# EAGLE design alarme2 (EAGLE 4.11)
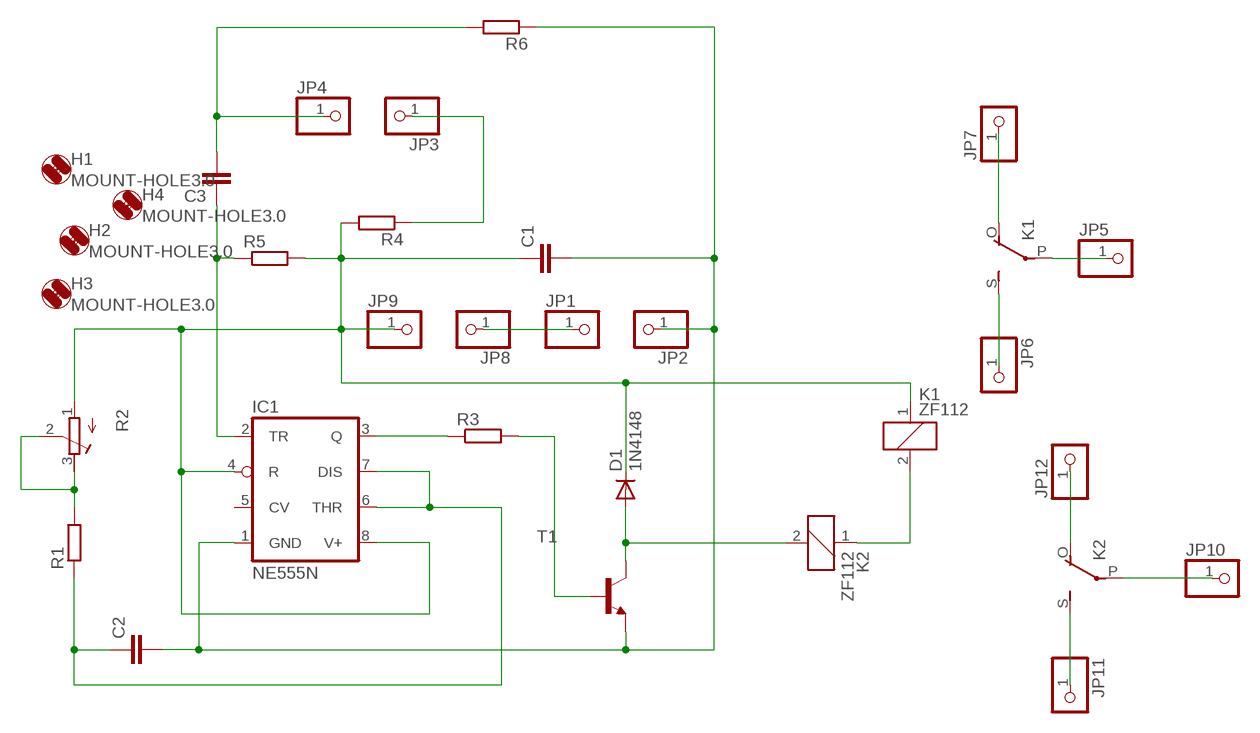
[diagram p0: schematic, sheet 1]

## Parts
C1  C-EU050-045X075  [C050-045X075]
C2  C-EU050-045X075  [C050-045X075]
C3  C-EU050-045X075  [C050-045X075]
D1  1N4148  [DO35-10]
H1  MOUNT-HOLE3.0  [3,0]
H2  MOUNT-HOLE3.0  [3,0]
H3  MOUNT-HOLE3.0  [3,0]
H4  MOUNT-HOLE3.0  [3,0]
IC1  NE555N  [DIL08]
JP1  PINHD-1X1  [1X01]
JP2  PINHD-1X1  [1X01]
JP3  PINHD-1X1  [1X01]
JP4  PINHD-1X1  [1X01]
JP5  PINHD-1X1  [1X01]
JP6  PINHD-1X1  [1X01]
JP7  PINHD-1X1  [1X01]
JP8  PINHD-1X1  [1X01]
JP9  PINHD-1X1  [1X01]
JP10  PINHD-1X1  [1X01]
JP11  PINHD-1X1  [1X01]
JP12  PINHD-1X1  [1X01]
K1  ZF112  [ZF112]
K2  ZF112  [ZF112]
R1  R-EU_0207/10  [0207/10]
R2  R-TRIMM3339P  [RTRIM3339P]
R3  R-EU_0207/10  [0207/10]
R4  R-EU_0207/10  [0207/10]
R5  R-EU_0207/10  [0207/10]
R6  R-EU_0207/10  [0207/10]
T1  BC548A-NPN-TO92-EBC  [TO92-EBC]

## Nets
N$1: C1.1 D1.C IC1.4(R) IC1.8(V+) JP9.1 K1.1 R2.1(E) R4.2 R5.2
N$2: C2.1 IC1.6(THR) IC1.7(DIS) R1.1
N$3: C1.2 C2.2 IC1.1(GND) JP2.1 R6.1 T1.E
N$4: R1.2 R2.2(S) R2.3(A)
N$5: IC1.3(Q) R3.1
N$6: R3.2 T1.B
N$7: JP6.1 K1.S(2:S)
N$8: C3.2 JP4.1 R6.2
N$39: D1.A K2.2 T1.C
N$40: JP5.1 K1.P(2:P)
N$46: JP7.1 K1.O(2:O)
N$48: JP1.1 JP8.1
N$51: JP3.1 R4.1
N$53: JP12.1 K2.O(2:O)
N$54: JP10.1 K2.P(2:P)
N$55: JP11.1 K2.S(2:S)
N$56: K1.2 K2.1
N$67: C3.1 IC1.2(TR) R5.1
Unconnected: IC1.5(CV)

## Library data of the parts
C1-C3 = rcl:C-EU: CAPACITOR, European symbol
D1 = diode:1N4148: DIODE high speed (Philips)
H1-H4 = holes:MOUNT-HOLE: MOUNTING HOLE with drill center marker
IC1 = linear:*555: TIMER
JP1-JP12 = pinhead:PINHD-1X1: PIN HEADER
K1 K2 = relay:ZF112: RELAY 1 x switch
R1 R3-R6 = rcl:R-EU_: RESISTOR, European symbol
R2 = rcl:R-TRIMM: Trimm resistor
T1 = transistor:*-NPN-: NPN Transistror

## Board
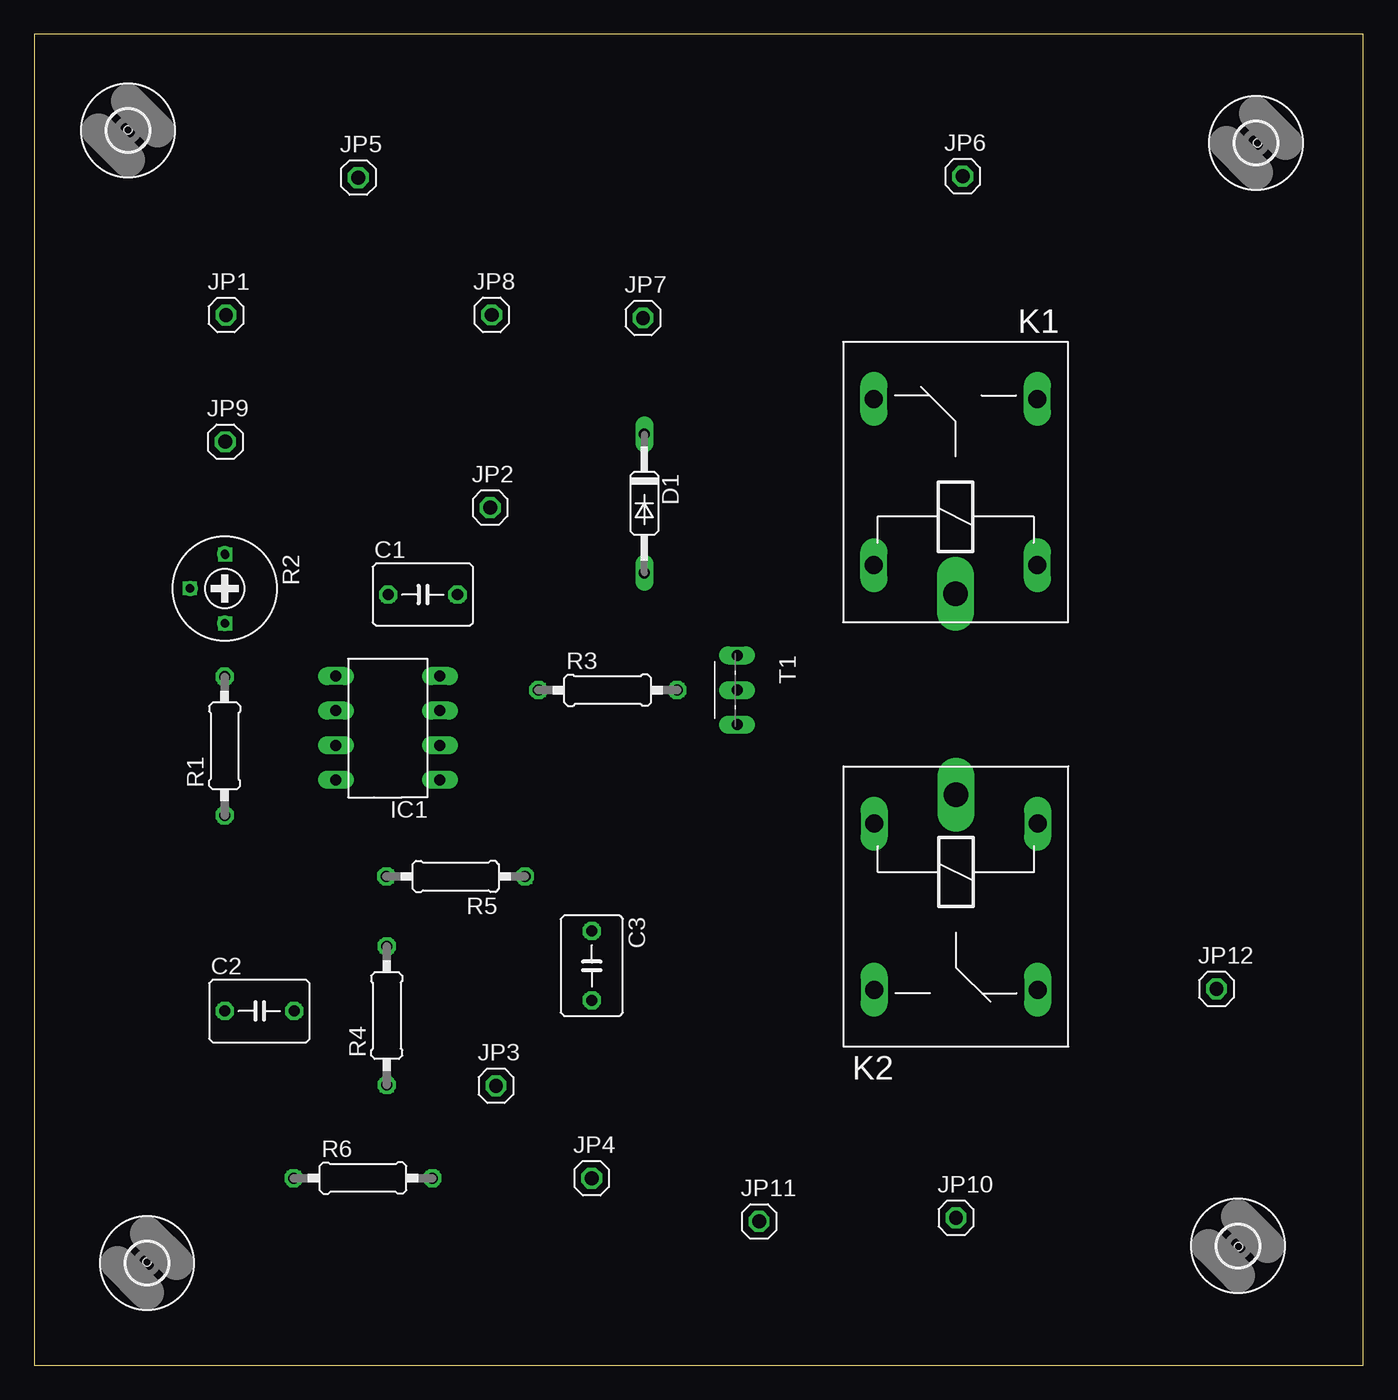
[diagram p1: board, top side]
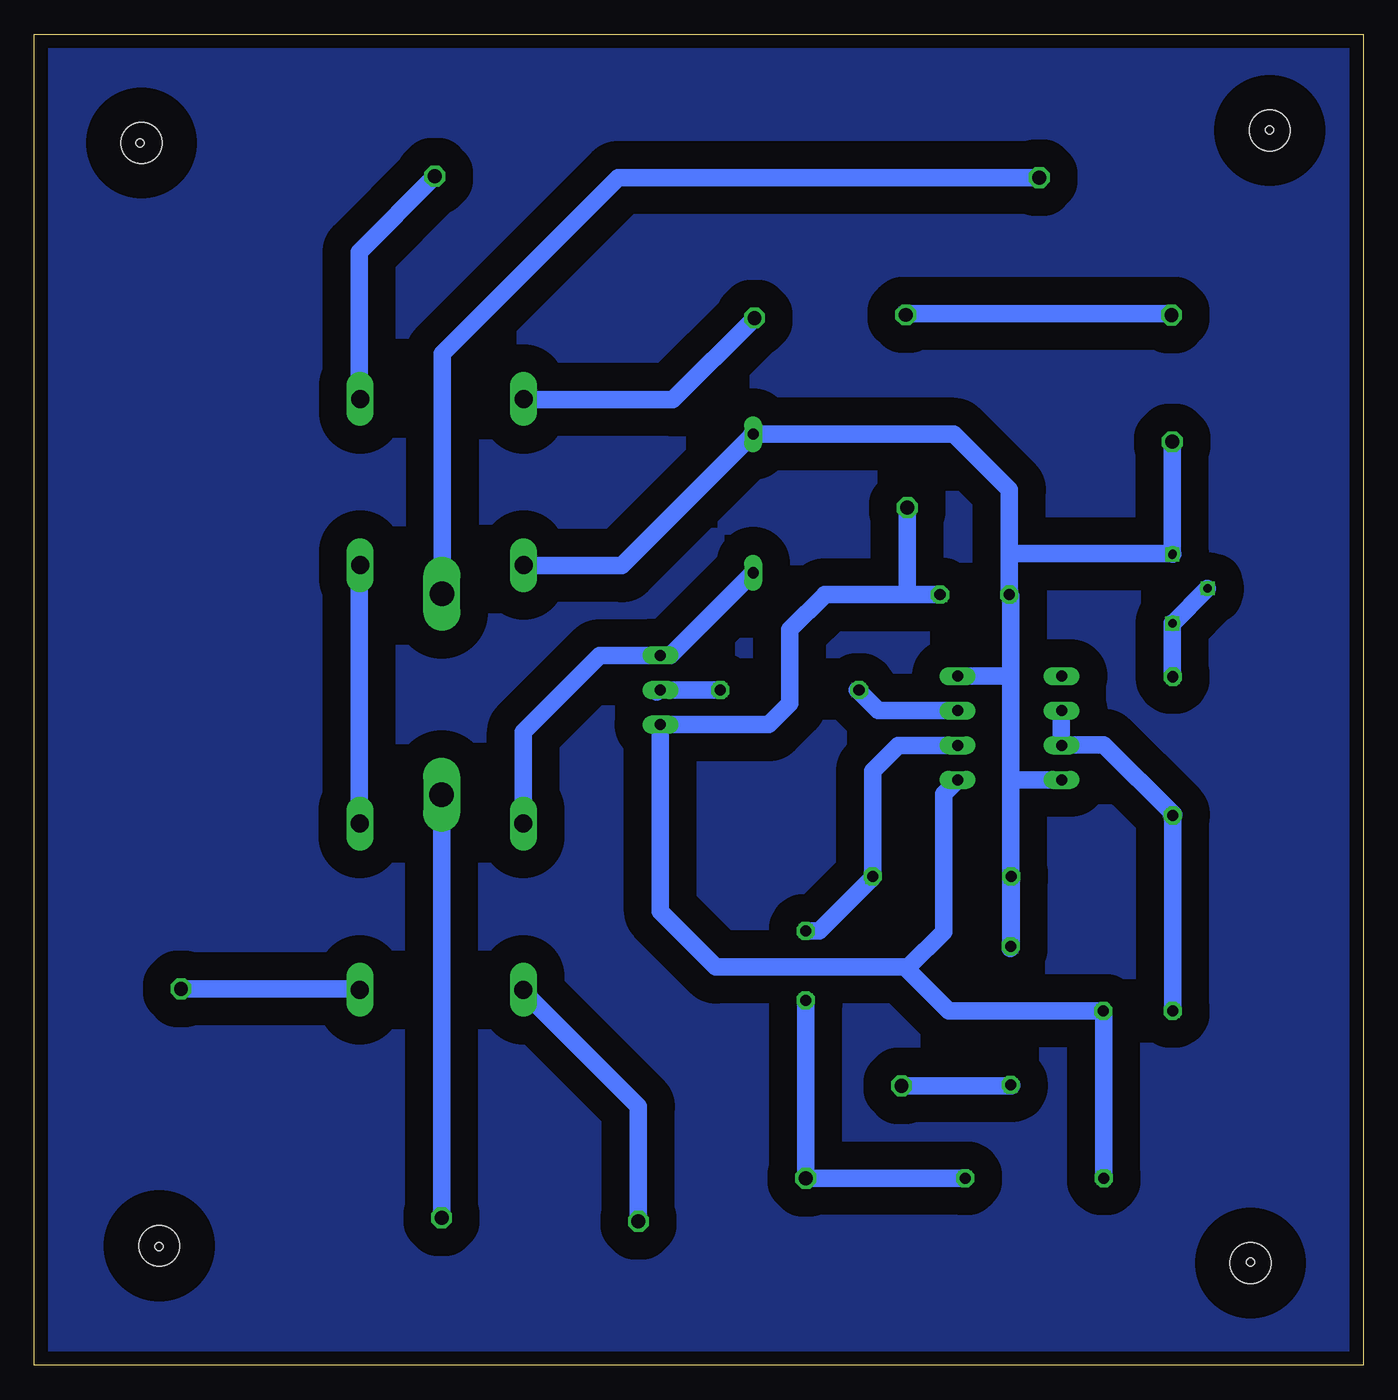
[diagram p2: board, bottom side, seen from below]

Size 97.46 x 97.64 mm. Coordinates in mm from the lower left corner, seen from the top.
Outline: 0,0 97.46,0 97.46,97.64 0,97.64 0,0
Copper layers 16: Bottom 0.035mm
Design rules "default": minimum track width 10mil, minimum drill 24mil, track to track 80mil, track to pad 80mil, pad to pad 80mil, via to via 80mil, smd to smd 80mil, copper to edge 40mil, drill to drill 8mil, minimum pad ring 10mil, minimum via ring 8mil, stop-mask expansion 4mil, vias tented up to drill 0mil, thermal gap 10mil
Holes 0.61 mm at 8.28,7.59 6.89,90.62 88.31,8.72 89.7,89.66

### Footprints (pad centres in the part's own frame; a part is rotated, then mirrored left to right if it is on the bottom)
C050-045X075 = drill 0.813 octagon: 1 -2.54,0; 2 2.54,0
DO35-10 = drill 0.813 long: A 5.08,0; C -5.08,0
3,0 = hole 3: 0,0
DIL08 = drill 0.813 long: 1 -3.81,-3.81; 2 -1.27,-3.81; 3 1.27,-3.81; 4 3.81,-3.81; 5 3.81,3.81; 6 1.27,3.81; 7 -1.27,3.81; 8 -3.81,3.81
1X01 = drill 1.016 octagon: 1 0,0
ZF112 = drill 1.321 long: 1 -6.096,5.994; 2 -6.096,-5.994; O 6.096,5.994; S 6.096,-5.994 | drill 1.803 long: P -8.204,0
0207/10 = drill 0.813 octagon: 1 -5.08,0; 2 5.08,0
RTRIM3339P = drill 0.61 round: 1 -2.54,0; 2 0,-2.54; 3 2.54,0
TO92-EBC = drill 0.813 long: B 0,-1.27; C -2.54,-1.27; E 2.54,-1.27

### Placement (x,y rotation side)
C1  28.5,56.53 0 top
C2  16.52,25.99 0 top
C3  40.89,29.31 270 top
D1  44.74,63.21 270 top
H1  88.28,8.77 0 top
H2  6.87,90.58 0 top
H3  8.28,7.51 0 top
H4  89.58,89.66 0 top
IC1  25.94,46.75 90 top
JP1  14.07,77.03 0 top
JP2  33.43,62.91 0 top
JP3  33.87,20.51 0 top
JP4  40.88,13.73 0 top
JP5  23.77,87.11 0 top
JP6  68.08,87.21 0 top
JP7  44.64,76.82 0 top
JP8  33.54,77.04 0 top
JP9  14.01,67.74 0 top
JP10  67.58,10.82 0 top
JP11  53.15,10.56 0 top
JP12  86.69,27.62 0 top
K1  67.56,64.78 90 top
K2  67.58,33.65 270 top
R1  13.97,45.43 90 top
R2  13.98,56.98 270 top
R3  42.06,49.52 0 top
R4  25.86,25.66 90 top
R5  30.91,35.87 180 top
R6  24.11,13.73 0 top
T1  52.82,49.53 270 top

### Tracks (layer width: path | path; a pad name or v marks a point on that pad's centre or on a via)
N$1
  Bottom 1.27: K1.1 61.55,58.67 61.55,58.66 54.37,58.66 D1.C 44.84,68.29 44.84,68.3 30.03,68.3 25.96,64.23 25.96,59.57 | 14.02,59.55 R2.1 | JP9.1 14.02,59.55 | 25.96,59.57 C1.1 25.86,56.44 25.86,50.52 | 25.96,59.57 25.86,59.57 25.84,59.55 14.02,59.55 | 25.86,30.61 25.9,30.57 | 25.86,30.61 R4.2 25.86,42.9 | R5.2 25.83,30.64 25.86,30.61 | 25.86,42.9 25.86,50.52 | 25.86,42.9 25.79,42.9 25.76,42.94 IC1.8 | 25.86,50.52 25.95,50.52 25.99,50.56 IC1.4
N$2
  Bottom 1.27: R1.1 14.03,40.29 | IC1.6 22.14,48.01 22.14,45.5 | 22.14,45.5 IC1.7 | 14.03,40.29 14.07,40.32 | R1.1 13.92,40.4 19.02,45.5 22.14,45.5 | R1.1 | 14.03,40.29 14,40.26 | R1.1 13.99,40.33 13.98,40.32 C2.1
N$3
  Bottom 1.27: 33.42,56.53 39.41,56.53 39.42,56.52 39.51,56.52 39.51,56.5 42.05,53.96 42.05,48.54 43.59,46.99 T1.E 51.55,33.3 47.47,29.22 33.52,29.22 | 33.42,56.53 C1.2 | 33.42,56.53 33.42,56.57 33.43,56.59 JP2.1 | IC1.1 30.78,41.9 30.78,31.8 33.36,29.22 33.52,29.22 | 33.52,29.22 33.52,29.12 30.39,25.99 C2.2 19.07,25.99 | 19.07,25.99 19.09,26.01 | R6.1 19.03,25.95 19.07,25.99
N$4
  Bottom 1.27: R2.3 14.03,54.44 14.03,54.36 | R1.2 14.03,50.51 14.03,54.36 | R2.2 14.03,54.39 14.03,54.36
N$5  (via drill 0.61)
  Bottom 1.27: 37.09,49.52 37.1,49.53 | 37.09,49.52 v36.99,49.52 R3.1 | IC1.3 35.59,48.02 37.09,49.52
N$6  (via drill 0.61)
  Bottom 1.27: 51.65,49.52 51.64,49.53 T1.B | R3.2 v51.54,49.52 51.65,49.52 | 51.65,49.52 51.79,49.38
  other vias: 47.14,49.52
N$7
  Bottom 1.27: K1.S 73.62,70.82 73.63,70.82 73.63,81.66 JP6.1
N$8
  Bottom 1.27: JP4.1 40.88,13.67 40.87,13.67 40.8,13.73 40.71,13.73 | R6.2 40.71,13.73 | 40.71,13.73 40.71,13.78 40.89,13.95 C3.2
N$9
  pour Bottom: 0.63,0.47 0.72,97.05 96.86,97.05 96.77,0.47
N$10  (via drill 0.61)
  other vias: 33.55,77.07
N$11  (via drill 0.61)
  other vias: 44.73,68.3
N$12  (via drill 0.61)
  other vias: 44.67,76.81
N$13  (via drill 0.61)
  other vias: 33.43,62.89
N$14  (via drill 0.61)
  other vias: 31.03,56.49
N$15  (via drill 0.61)
  other vias: 44.81,58.14
N$16  (via drill 0.61)
  other vias: 14.05,67.69
N$17  (via drill 0.61)
  other vias: 51.58,52.07
N$18  (via drill 0.61)
  other vias: 14.01,59.46
N$19  (via drill 0.61)
  other vias: 25.95,56.49
N$20  (via drill 0.61)
  other vias: 29.74,50.53
N$21  (via drill 0.61)
  other vias: 67.6,10.81
N$22  (via drill 0.61)
  other vias: 14.01,54.4
N$23  (via drill 0.61)
  other vias: 13.96,50.49
N$24  (via drill 0.61)
  other vias: 22.14,47.98
N$25  (via drill 0.61)
  other vias: 29.74,48.03
N$26  (via drill 0.61)
  other vias: 29.74,45.43
N$27  (via drill 0.61)
  other vias: 29.79,42.88
N$28  (via drill 0.61)
  other vias: 22.14,42.93
N$29  (via drill 0.61)
  other vias: 22.14,45.43
N$30  (via drill 0.61)
  other vias: 53.14,10.54
N$31  (via drill 0.61)
  other vias: 13.96,40.33
N$32  (via drill 0.61)
  other vias: 40.89,13.71
N$33  (via drill 0.61)
  other vias: 40.89,26.78
N$34  (via drill 0.61)
  other vias: 51.54,46.97
N$36  (via drill 0.61)
  other vias: 40.89,31.86
N$37  (via drill 0.61)
  other vias: 33.85,20.49
N$38  (via drill 0.61)
  other vias: 11.41,57
N$39
  Bottom 1.27: T1.C 51.62,52.07 | T1.C 51.56,52.06 55.99,52.06 61.59,46.46 K2.2 | D1.A 50.8,52.07 T1.C
N$40
  Bottom 1.27: JP5.1 54.63,87.11 67.55,74.2 67.55,56.83 67.72,56.66 67.64,56.58 K1.P
N$41  (via drill 0.61)
  other vias: 14.09,77.07
N$42  (via drill 0.61)
  other vias: 23.78,87.14
N$43  (via drill 0.61)
  other vias: 68.08,87.23
N$44  (via drill 0.61)
  other vias: 25.86,20.53
N$45  (via drill 0.61)
  other vias: 25.86,30.74
N$46
  Bottom 1.27: K1.O 61.55,70.86 61.55,70.82 50.64,70.82 JP7.1
N$47  (via drill 0.61)
  other vias: 25.86,35.86
N$48
  Bottom 1.27: JP8.1 33.66,77.15 33.66,77.16 14.19,77.16 JP1.1
N$49  (via drill 0.61)
  other vias: 61.61,27.52
N$50  (via drill 0.61)
  other vias: 73.64,27.52
N$51
  Bottom 1.27: R4.1 25.84,20.58 25.79,20.53 25.82,20.51 JP3.1
N$52  (via drill 0.61)
  other vias: 22.17,50.58
N$53
  Bottom 1.27: K2.O 73.64,27.55 73.71,27.48 73.85,27.62 JP12.1
N$54
  Bottom 1.27: 67.58,41.91 K2.P | JP10.1 67.58,41.91 | 67.58,41.91 67.59,41.92
N$55
  Bottom 1.27: K2.S 61.59,27.52 61.64,27.47 53.15,18.98 JP11.1
N$56
  Bottom 1.27: 73.63,39.69 73.63,39.64 | K2.1 73.63,39.69 | K1.2 73.63,58.61 73.63,39.69
N$57  (via drill 0.61)
  other vias: 67.6,41.81
N$58  (via drill 0.61)
  other vias: 73.59,39.77
N$59  (via drill 0.61)
  other vias: 61.61,39.77
N$60  (via drill 0.61)
  other vias: 61.61,58.7
N$61  (via drill 0.61)
  other vias: 67.6,56.62
N$62  (via drill 0.61)
  other vias: 73.59,58.66
N$63  (via drill 0.61)
  other vias: 73.59,70.86
N$64  (via drill 0.61)
  other vias: 61.56,70.86
N$65  (via drill 0.61)
  other vias: 36.03,35.82
N$66  (via drill 0.61)
  other vias: 19.09,26
N$67
  Bottom 1.27: IC1.2 29.76,45.48 29.82,45.43 29.87,45.48 34.11,45.48 35.99,43.6 R5.1 35.99,35.77 39.9,31.85 C3.1
N$68  (via drill 0.61)
  other vias: 13.96,26
N$69  (via drill 0.61)
  other vias: 86.67,27.61
N$70  (via drill 0.61)
  other vias: 29.21,13.76
N$71  (via drill 0.61)
  other vias: 19.04,13.76